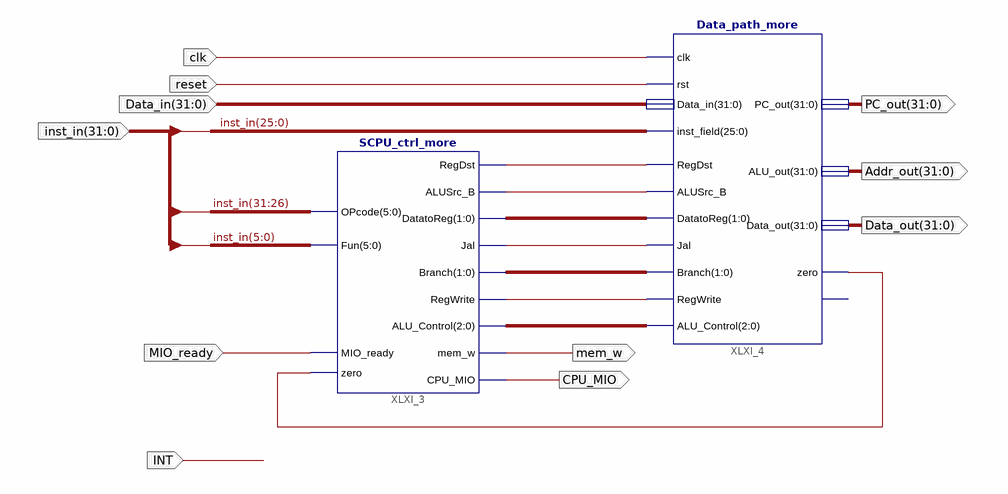
[diagram p0: schematic sheet 1]
// Xilinx ISE schematic SCPU_More.sch (kintex7) as structural Verilog: 2 symbols, 11 ports
module SCPU_More (
  input  clk,
  input  reset,
  input  [31:0] Data_in,
  input  MIO_ready,
  input  [31:0] inst_in,
  input  INT,
  output CPU_MIO,
  output mem_w,
  output [31:0] PC_out,
  output [31:0] Addr_out,
  output [31:0] Data_out
);

  wire XLXN_1, XLXN_2, XLXN_4, XLXN_6, XLXN_21;
  wire [1:0] XLXN_22, XLXN_23;
  wire [2:0] XLXN_7;

  SCPU_ctrl_more XLXI_3 (
    .RegDst(XLXN_1), .ALUSrc_B(XLXN_2), .DatatoReg(XLXN_22), .Jal(XLXN_4), .ALU_Control(XLXN_7),
    .CPU_MIO(CPU_MIO), .mem_w(mem_w), .Fun(inst_in[5:0]), .OPcode(inst_in[31:26]), .Branch(XLXN_23),
    .RegWrite(XLXN_6), .MIO_ready(MIO_ready), .zero(XLXN_21));
  Data_path_more XLXI_4 (
    .RegDst(XLXN_1), .ALUSrc_B(XLXN_2), .DatatoReg(XLXN_22), .Jal(XLXN_4), .Branch(XLXN_23),
    .RegWrite(XLXN_6), .ALU_Control(XLXN_7), .Data_in(Data_in), .inst_field(inst_in[25:0]), .clk(clk),
    .rst(reset), .PC_out(PC_out), .ALU_out(Addr_out), .Data_out(Data_out), .zero(XLXN_21));  // open: overflow
endmodule
